# Altium project Metlino.PrjPcb (part 4 of 13)

## Sheet SDRAM_DDR3_4x16.SchDoc: Metlino
size 420 x 297 mm; CheckedBy: P.Kulik,T.Przywozki,W.Ruclo; Author: G.Kasprowicz; CompanyName: WUT ISE; DrawnBy: G.Kasprowicz; Organization: WUT ISE; Address1: PW ISE; Address2: Nowowiejska 15/19 00-665 Warsaw; Address3: gkasprow@gmail.com; DocumentNumber: 4; Revision: 2; SheetNumber: 4; SheetTotal: 29; ModifiedBy: -; CheckedDate: -; Title2: DDR3 x64; DivGrp: WUT ISE; Designer: G.Kasprowicz; ModifiedDate: -; ProjectName: Sensor Box
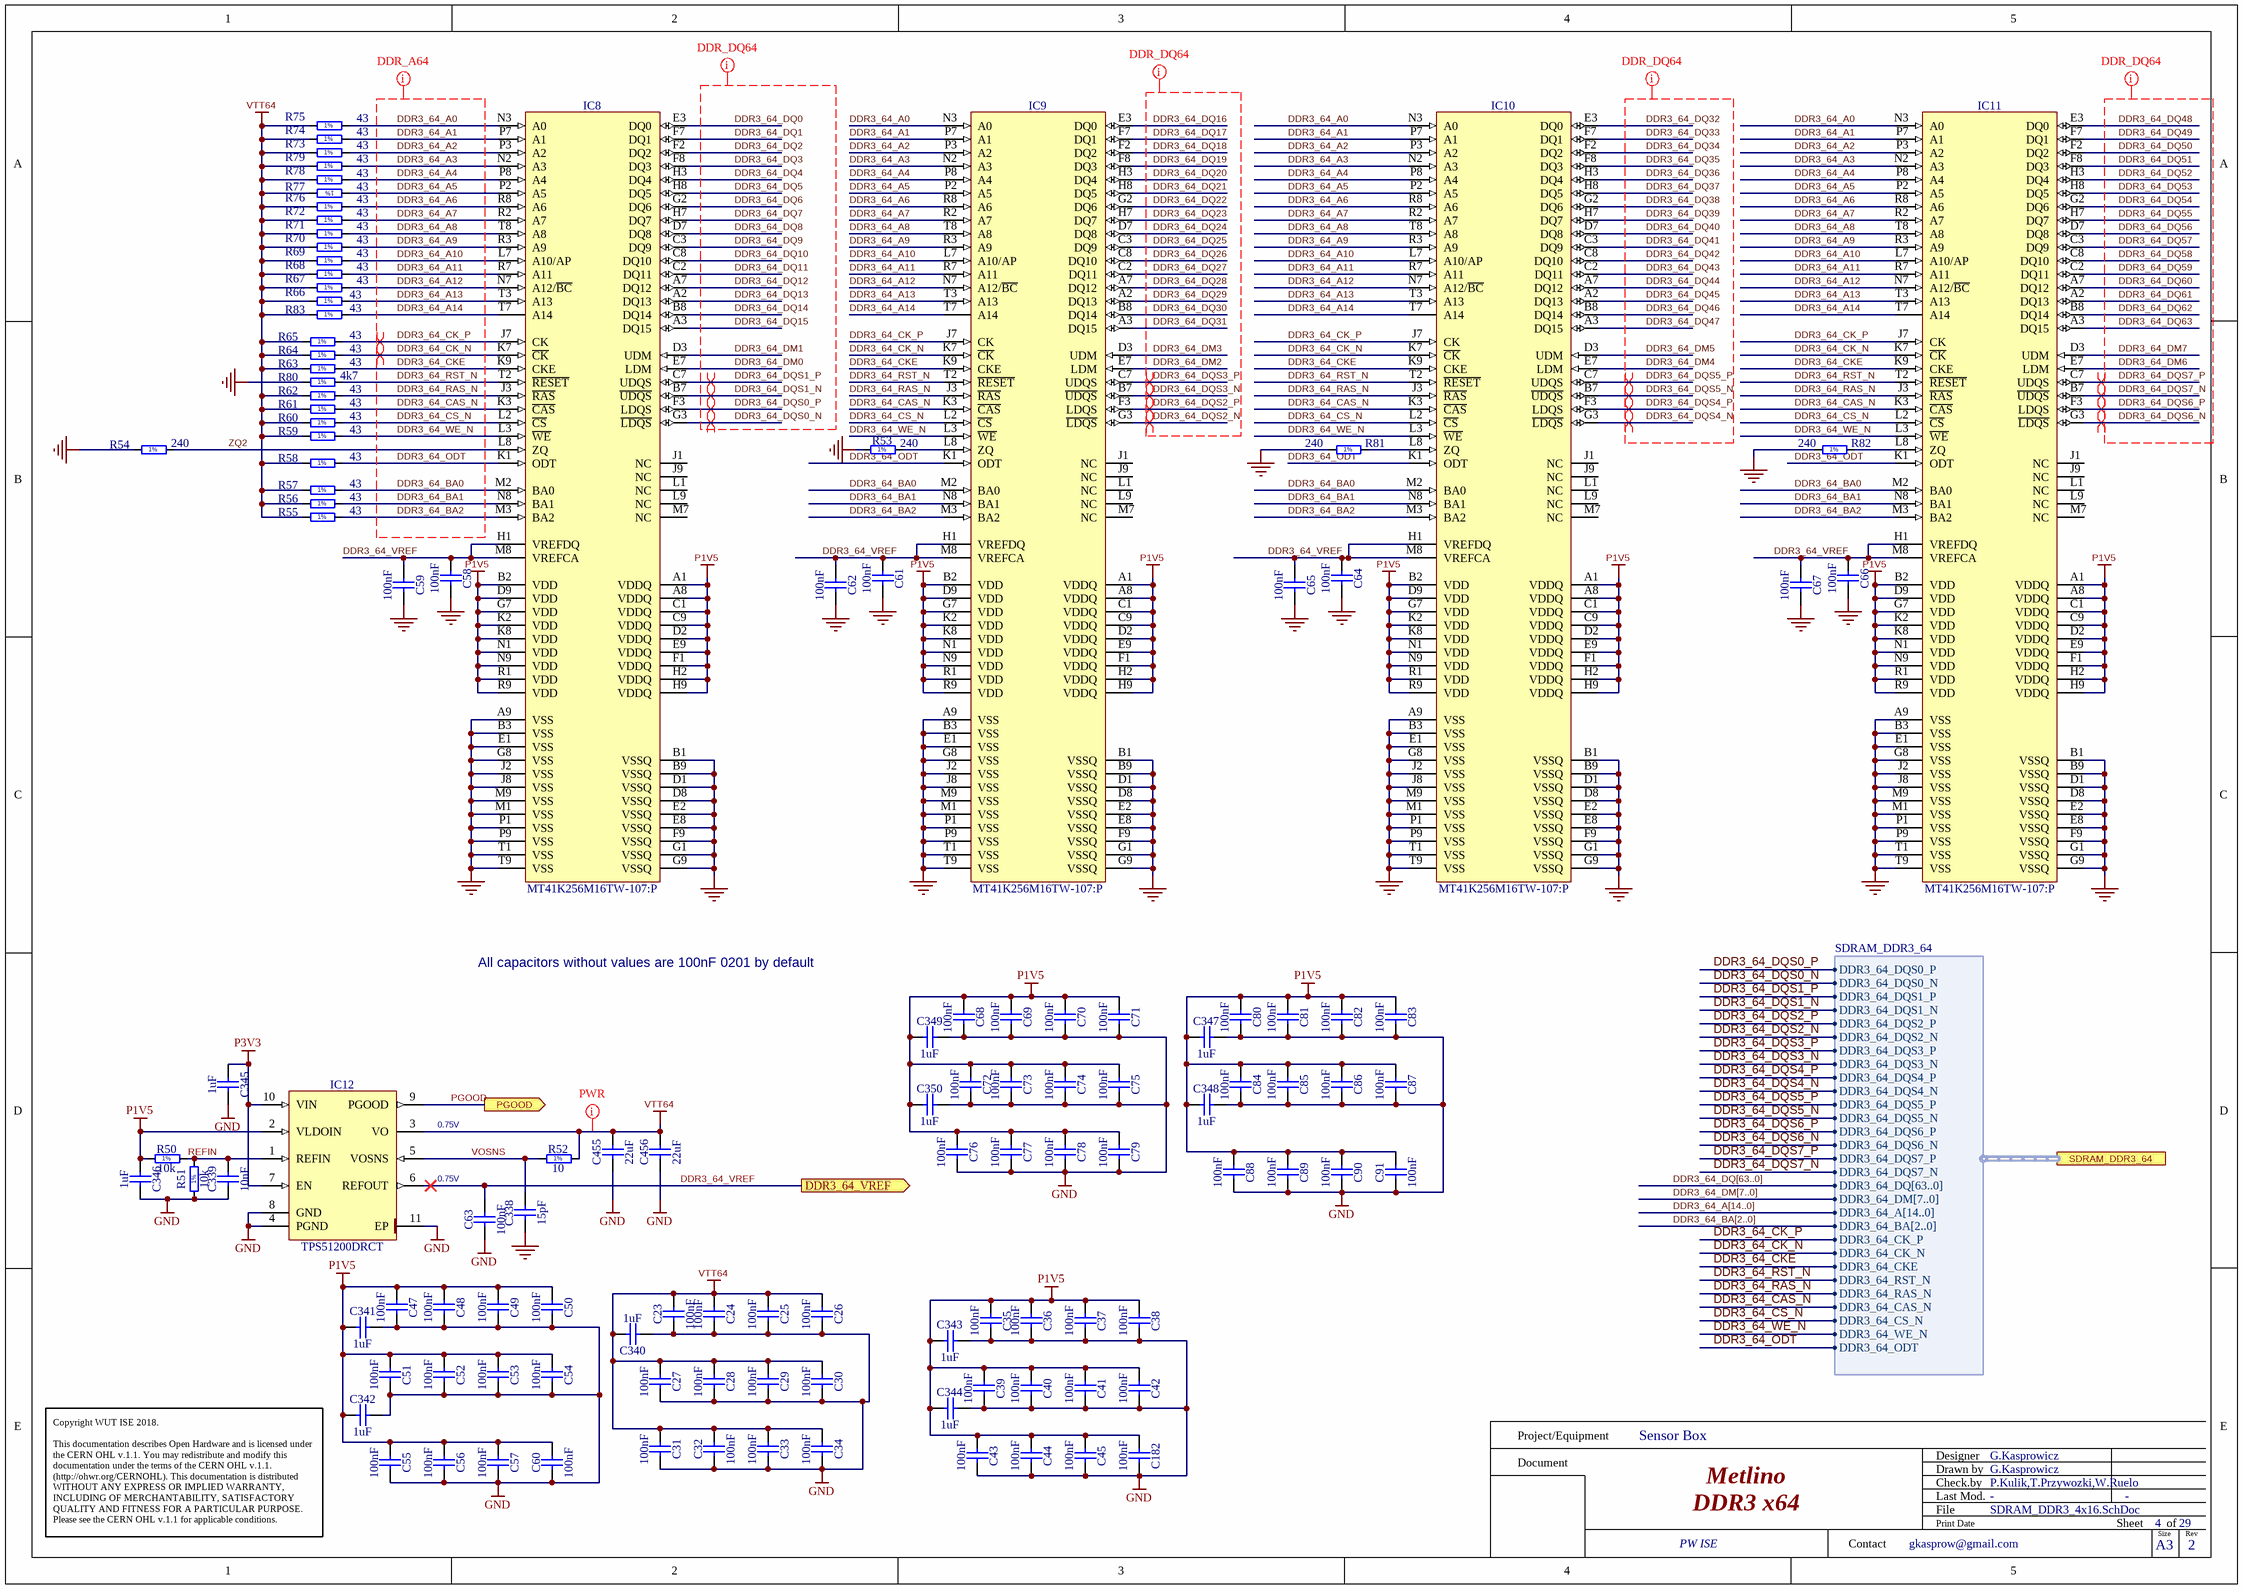
[diagram p6: SDRAM_DDR3_4x16.SchDoc]

### Parts
C23  100nF  [CAPC0603X33N]
C24  100nF  [CAPC0603X33N]
C25  100nF  [CAPC0603X33N]
C26  100nF  [CAPC0603X33N]
C27  100nF  [CAPC0603X33N]
C28  100nF  [CAPC0603X33N]
C29  100nF  [CAPC0603X33N]
C30  100nF  [CAPC0603X33N]
C31  100nF  [CAPC0603X33N]
C32  100nF  [CAPC0603X33N]
C33  100nF  [CAPC0603X33N]
C34  100nF  [CAPC0603X33N]
C35  100nF  [CAPC0603X33N]
C36  100nF  [CAPC0603X33N]
C37  100nF  [CAPC0603X33N]
C38  100nF  [CAPC0603X33N]
C39  100nF  [CAPC0603X33N]
C40  100nF  [CAPC0603X33N]
C41  100nF  [CAPC0603X33N]
C42  100nF  [CAPC0603X33N]
C43  100nF  [CAPC0603X33N]
C44  100nF  [CAPC0603X33N]
C45  100nF  [CAPC0603X33N]
C47  100nF  [CAPC0603X33N]
C48  100nF  [CAPC0603X33N]
C49  100nF  [CAPC0603X33N]
C50  100nF  [CAPC0603X33N]
C51  100nF  [CAPC0603X33N]
C52  100nF  [CAPC0603X33N]
C53  100nF  [CAPC0603X33N]
C54  100nF  [CAPC0603X33N]
C55  100nF  [CAPC0603X33N]
C56  100nF  [CAPC0603X33N]
C57  100nF  [CAPC0603X33N]
C58  100nF  [CAPC0603X33N]
C59  100nF  [CAPC0603X33N]
C60  100nF  [CAPC0603X33N]
C61  100nF  [CAPC0603X33N]
C62  100nF  [CAPC0603X33N]
C63  100nF  [CAPC0603X33N]
C64  100nF  [CAPC0603X33N]
C65  100nF  [CAPC0603X33N]
C66  100nF  [CAPC0603X33N]
C67  100nF  [CAPC0603X33N]
C68  100nF  [CAPC0603X33N]
C69  100nF  [CAPC0603X33N]
C70  100nF  [CAPC0603X33N]
C71  100nF  [CAPC0603X33N]
C72  100nF  [CAPC0603X33N]
C73  100nF  [CAPC0603X33N]
C74  100nF  [CAPC0603X33N]
C75  100nF  [CAPC0603X33N]
C76  100nF  [CAPC0603X33N]
C77  100nF  [CAPC0603X33N]
C78  100nF  [CAPC0603X33N]
C79  100nF  [CAPC0603X33N]
C80  100nF  [CAPC0603X33N]
C81  100nF  [CAPC0603X33N]
C82  100nF  [CAPC0603X33N]
C83  100nF  [CAPC0603X33N]
C84  100nF  [CAPC0603X33N]
C85  100nF  [CAPC0603X33N]
C86  100nF  [CAPC0603X33N]
C87  100nF  [CAPC0603X33N]
C88  100nF  [CAPC0603X33N]
C89  100nF  [CAPC0603X33N]
C90  100nF  [CAPC0603X33N]
C91  100nF  [CAPC0603X33N]
C182  100nF  [CAPC0603X33N]
C338  15pF  [CAPC1005X55N]
C339  10nF  [CAPC1005X55N]
C340  1uF  [CAPC1005X55N]
C341  1uF  [CAPC1005X55N]
C342  1uF  [CAPC1005X55N]
C343  1uF  [CAPC1005X55N]
C344  1uF  [CAPC1005X55N]
C345  1uF  [CAPC1005X55N]
C346  1uF  [CAPC1005X55N]
C347  1uF  [CAPC1005X55N]
C348  1uF  [CAPC1005X55N]
C349  1uF  [CAPC1005X55N]
C350  1uF  [CAPC1005X55N]
C455  22uF  [CAPC2012X135N]
C456  22uF  [CAPC2012X135N]
IC8  MT41K256M16TW-107:P  [BGA96C80P9X16_800X1400X120]
IC9  MT41K256M16TW-107:P  [BGA96C80P9X16_800X1400X120]
IC10  MT41K256M16TW-107:P  [BGA96C80P9X16_800X1400X120]
IC11  MT41K256M16TW-107:P  [BGA96C80P9X16_800X1400X120]
IC12  TPS51200DRCT  [TEXAS_DRC (S-PVSON-N10)]
R50  10k  [RESC1005X40N]
R51  10k  [RESC1005X40N]
R52  10  [RESC1005X40N]
R53  240  [RESC1005X40N]
R54  240  [RESC1005X40N]
R55  43  [RESC1005X40N]
R56  43  [RESC1005X40N]
R57  43  [RESC1005X40N]
R58  43  [RESC1005X40N]
R59  43  [RESC1005X40N]
R60  43  [RESC1005X40N]
R61  43  [RESC1005X40N]
R62  43  [RESC1005X40N]
R63  43  [RESC1005X40N]
R64  43  [RESC1005X40N]
R65  43  [RESC1005X40N]
R66  43  [RESC1005X40N]
R67  43  [RESC1005X40N]
R68  43  [RESC1005X40N]
R69  43  [RESC1005X40N]
R70  43  [RESC1005X40N]
R71  43  [RESC1005X40N]
R72  43  [RESC1005X40N]
R73  43  [RESC1005X40N]
R74  43  [RESC1005X40N]
R75  43  [RESC1005X40N]
R76  43  [RESC1005X40N]
R77  43  [RESC1005X40N]
R78  43  [RESC1005X40N]
R79  43  [RESC1005X40N]
R80  4k7  [RESC1005X40N]
R81  240  [RESC1005X40N]
R82  240  [RESC1005X40N]
R83  43  [RESC1005X40N]

### Ports
DDR3_64_VREF (out), PGOOD (out), SDRAM_DDR3_64 (harness SDRAM_DDR3_64)

### Harnesses
SDRAM_DDR3_64: DDR3_64_DQS0_P, DDR3_64_DQS0_N, DDR3_64_DQS1_P, DDR3_64_DQS1_N, DDR3_64_DQS2_P, DDR3_64_DQS2_N, DDR3_64_DQS3_P, DDR3_64_DQS3_N, DDR3_64_DQS4_P, DDR3_64_DQS4_N, DDR3_64_DQS5_P, DDR3_64_DQS5_N, DDR3_64_DQS6_P, DDR3_64_DQS6_N, DDR3_64_DQS7_P, DDR3_64_DQS7_N, DDR3_64_DQ[63..0], DDR3_64_DM[7..0], DDR3_64_A[14..0], DDR3_64_BA[2..0], DDR3_64_CK_P, DDR3_64_CK_N, DDR3_64_CKE, DDR3_64_RST_N, DDR3_64_RAS_N, DDR3_64_CAS_N, DDR3_64_CS_N, DDR3_64_WE_N, DDR3_64_ODT

### Nets
GND: C23.2 C24.2 C25.2 C26.2 C27.2 C28.2 C29.2 C30.2 C31.2 C32.2 C33.2 C34.2 C35.2 C36.2 C37.2 C38.2 C39.2 C40.2 C41.2 C42.2 C43.2 C44.2 C45.2 C47.2 C48.2 C49.2 C50.2 C51.2 C52.2 C53.2 C54.2 C55.2 C56.2 C57.2 C58.2 C59.2 C60.1 C61.2 C62.2 C63.1 C64.2 C65.2 C66.2 C67.2 C68.2 C69.2 C70.2 C71.2 C72.2 C73.2 C74.2 C75.2 C76.2 C77.2 C78.2 C79.2 C80.2 C81.2 C82.2 C83.2 C84.2 C85.2 C86.2 C87.2 C88.2 C89.2 C90.2 C91.1 C182.2 C338.1 C339.1 C340.2 C341.2 C342.2 C343.2 C344.2 C345.2 C346.2 C347.2 C348.2 C349.2 C350.2 C455.1 C456.1 IC8.A9(VSS) IC8.B1(VSSQ) IC8.B3(VSS) IC8.B9(VSSQ) IC8.D1(VSSQ) IC8.D8(VSSQ) IC8.E1(VSS) IC8.E2(VSSQ) IC8.E8(VSSQ) IC8.F9(VSSQ) IC8.G1(VSSQ) IC8.G8(VSS) IC8.G9(VSSQ) IC8.J2(VSS) IC8.J8(VSS) IC8.M1(VSS) IC8.M9(VSS) IC8.P1(VSS) IC8.P9(VSS) IC8.T1(VSS) IC8.T9(VSS) IC9.A9(VSS) IC9.B1(VSSQ) IC9.B3(VSS) IC9.B9(VSSQ) IC9.D1(VSSQ) IC9.D8(VSSQ) IC9.E1(VSS) IC9.E2(VSSQ) IC9.E8(VSSQ) IC9.F9(VSSQ) IC9.G1(VSSQ) IC9.G8(VSS) IC9.G9(VSSQ) IC9.J2(VSS) IC9.J8(VSS) IC9.M1(VSS) IC9.M9(VSS) IC9.P1(VSS) IC9.P9(VSS) IC9.T1(VSS) IC9.T9(VSS) IC10.A9(VSS) IC10.B1(VSSQ) IC10.B3(VSS) IC10.B9(VSSQ) IC10.D1(VSSQ) IC10.D8(VSSQ) IC10.E1(VSS) IC10.E2(VSSQ) IC10.E8(VSSQ) IC10.F9(VSSQ) IC10.G1(VSSQ) IC10.G8(VSS) IC10.G9(VSSQ) IC10.J2(VSS) IC10.J8(VSS) IC10.M1(VSS) IC10.M9(VSS) IC10.P1(VSS) IC10.P9(VSS) IC10.T1(VSS) IC10.T9(VSS) IC11.A9(VSS) IC11.B1(VSSQ) IC11.B3(VSS) IC11.B9(VSSQ) IC11.D1(VSSQ) IC11.D8(VSSQ) IC11.E1(VSS) IC11.E2(VSSQ) IC11.E8(VSSQ) IC11.F9(VSSQ) IC11.G1(VSSQ) IC11.G8(VSS) IC11.G9(VSSQ) IC11.J2(VSS) IC11.J8(VSS) IC11.M1(VSS) IC11.M9(VSS) IC11.P1(VSS) IC11.P9(VSS) IC11.T1(VSS) IC11.T9(VSS) IC12.4(PGND) IC12.8(GND) IC12.11(EP) R51.1 R53.1 R54.1 R80.1 R81.1 R82.1
P1V5: C35.1 C36.1 C37.1 C38.1 C39.1 C40.1 C41.1 C42.1 C43.1 C44.1 C45.1 C47.1 C48.1 C49.1 C50.1 C51.1 C52.1 C53.1 C54.1 C55.1 C56.1 C57.1 C60.2 C68.1 C69.1 C70.1 C71.1 C72.1 C73.1 C74.1 C75.1 C76.1 C77.1 C78.1 C79.1 C80.1 C81.1 C82.1 C83.1 C84.1 C85.1 C86.1 C87.1 C88.1 C89.1 C90.1 C91.2 C182.1 C341.1 C342.1 C343.1 C344.1 C346.1 C347.1 C348.1 C349.1 C350.1 IC8.A1(VDDQ) IC8.A8(VDDQ) IC8.B2(VDD) IC8.C1(VDDQ) IC8.C9(VDDQ) IC8.D2(VDDQ) IC8.D9(VDD) IC8.E9(VDDQ) IC8.F1(VDDQ) IC8.G7(VDD) IC8.H2(VDDQ) IC8.H9(VDDQ) IC8.K2(VDD) IC8.K8(VDD) IC8.N1(VDD) IC8.N9(VDD) IC8.R1(VDD) IC8.R9(VDD) IC9.A1(VDDQ) IC9.A8(VDDQ) IC9.B2(VDD) IC9.C1(VDDQ) IC9.C9(VDDQ) IC9.D2(VDDQ) IC9.D9(VDD) IC9.E9(VDDQ) IC9.F1(VDDQ) IC9.G7(VDD) IC9.H2(VDDQ) IC9.H9(VDDQ) IC9.K2(VDD) IC9.K8(VDD) IC9.N1(VDD) IC9.N9(VDD) IC9.R1(VDD) IC9.R9(VDD) IC10.A1(VDDQ) IC10.A8(VDDQ) IC10.B2(VDD) IC10.C1(VDDQ) IC10.C9(VDDQ) IC10.D2(VDDQ) IC10.D9(VDD) IC10.E9(VDDQ) IC10.F1(VDDQ) IC10.G7(VDD) IC10.H2(VDDQ) IC10.H9(VDDQ) IC10.K2(VDD) IC10.K8(VDD) IC10.N1(VDD) IC10.N9(VDD) IC10.R1(VDD) IC10.R9(VDD) IC11.A1(VDDQ) IC11.A8(VDDQ) IC11.B2(VDD) IC11.C1(VDDQ) IC11.C9(VDDQ) IC11.D2(VDDQ) IC11.D9(VDD) IC11.E9(VDDQ) IC11.F1(VDDQ) IC11.G7(VDD) IC11.H2(VDDQ) IC11.H9(VDDQ) IC11.K2(VDD) IC11.K8(VDD) IC11.N1(VDD) IC11.N9(VDD) IC11.R1(VDD) IC11.R9(VDD) IC12.2(VLDOIN) R50.1
P3V3: C345.1 IC12.7(EN) IC12.10(VIN)
VTT64: C23.1 C24.1 C25.1 C26.1 C27.1 C28.1 C29.1 C30.1 C31.1 C32.1 C33.1 C34.1 C340.1 C455.2 C456.2 IC12.3(VO) R52.2 R55.1 R56.1 R57.1 R58.1 R59.1 R60.1 R61.1 R62.1 R63.1 R64.1 R65.1 R66.1 R67.1 R68.1 R69.1 R70.1 R71.1 R72.1 R73.1 R74.1 R75.1 R76.1 R77.1 R78.1 R79.1 R83.1
DDR3_64_A0: IC8.N3(A0) IC9.N3(A0) IC10.N3(A0) IC11.N3(A0) R75.2
DDR3_64_A1: IC8.P7(A1) IC9.P7(A1) IC10.P7(A1) IC11.P7(A1) R74.2
DDR3_64_A2: IC8.P3(A2) IC9.P3(A2) IC10.P3(A2) IC11.P3(A2) R73.2
DDR3_64_A3: IC8.N2(A3) IC9.N2(A3) IC10.N2(A3) IC11.N2(A3) R79.2
DDR3_64_A4: IC8.P8(A4) IC9.P8(A4) IC10.P8(A4) IC11.P8(A4) R78.2
DDR3_64_A5: IC8.P2(A5) IC9.P2(A5) IC10.P2(A5) IC11.P2(A5) R77.2
DDR3_64_A6: IC8.R8(A6) IC9.R8(A6) IC10.R8(A6) IC11.R8(A6) R76.2
DDR3_64_A7: IC8.R2(A7) IC9.R2(A7) IC10.R2(A7) IC11.R2(A7) R72.2
DDR3_64_A8: IC8.T8(A8) IC9.T8(A8) IC10.T8(A8) IC11.T8(A8) R71.2
DDR3_64_A9: IC8.R3(A9) IC9.R3(A9) IC10.R3(A9) IC11.R3(A9) R70.2
DDR3_64_A10: IC8.L7(A10/AP) IC9.L7(A10/AP) IC10.L7(A10/AP) IC11.L7(A10/AP) R69.2
DDR3_64_A11: IC8.R7(A11) IC9.R7(A11) IC10.R7(A11) IC11.R7(A11) R68.2
DDR3_64_A12: IC8.N7(A12/~{BC}) IC9.N7(A12/~{BC}) IC10.N7(A12/~{BC}) IC11.N7(A12/~{BC}) R67.2
DDR3_64_A13: IC8.T3(A13) IC9.T3(A13) IC10.T3(A13) IC11.T3(A13) R66.2
DDR3_64_A14: IC8.T7(A14) IC9.T7(A14) IC10.T7(A14) IC11.T7(A14) R83.2
DDR3_64_BA0: IC8.M2(BA0) IC9.M2(BA0) IC10.M2(BA0) IC11.M2(BA0) R57.2
DDR3_64_BA1: IC8.N8(BA1) IC9.N8(BA1) IC10.N8(BA1) IC11.N8(BA1) R56.2
DDR3_64_BA2: IC8.M3(BA2) IC9.M3(BA2) IC10.M3(BA2) IC11.M3(BA2) R55.2
DDR3_64_CAS_N: IC8.K3(~{CAS}) IC9.K3(~{CAS}) IC10.K3(~{CAS}) IC11.K3(~{CAS}) R61.2 ; port SDRAM_DDR3_64.DDR3_64_CAS_N
DDR3_64_CK_N: IC8.K7(~{CK}) IC9.K7(~{CK}) IC10.K7(~{CK}) IC11.K7(~{CK}) R64.2 ; port SDRAM_DDR3_64.DDR3_64_CK_N
DDR3_64_CK_P: IC8.J7(CK) IC9.J7(CK) IC10.J7(CK) IC11.J7(CK) R65.2 ; port SDRAM_DDR3_64.DDR3_64_CK_P
DDR3_64_CKE: IC8.K9(CKE) IC9.K9(CKE) IC10.K9(CKE) IC11.K9(CKE) R63.2 ; port SDRAM_DDR3_64.DDR3_64_CKE
DDR3_64_CS_N: IC8.L2(~{CS}) IC9.L2(~{CS}) IC10.L2(~{CS}) IC11.L2(~{CS}) R60.2 ; port SDRAM_DDR3_64.DDR3_64_CS_N
DDR3_64_DM0: IC8.E7(LDM)
DDR3_64_DM1: IC8.D3(UDM)
DDR3_64_DM2: IC9.E7(LDM)
DDR3_64_DM3: IC9.D3(UDM)
DDR3_64_DM4: IC10.E7(LDM)
DDR3_64_DM5: IC10.D3(UDM)
DDR3_64_DM6: IC11.E7(LDM)
DDR3_64_DM7: IC11.D3(UDM)
DDR3_64_DQ0: IC8.E3(DQ0)
DDR3_64_DQ1: IC8.F7(DQ1)
DDR3_64_DQ2: IC8.F2(DQ2)
DDR3_64_DQ3: IC8.F8(DQ3)
DDR3_64_DQ4: IC8.H3(DQ4)
DDR3_64_DQ5: IC8.H8(DQ5)
DDR3_64_DQ6: IC8.G2(DQ6)
DDR3_64_DQ7: IC8.H7(DQ7)
DDR3_64_DQ8: IC8.D7(DQ8)
DDR3_64_DQ9: IC8.C3(DQ9)
DDR3_64_DQ10: IC8.C8(DQ10)
DDR3_64_DQ11: IC8.C2(DQ11)
DDR3_64_DQ12: IC8.A7(DQ12)
DDR3_64_DQ13: IC8.A2(DQ13)
DDR3_64_DQ14: IC8.B8(DQ14)
DDR3_64_DQ15: IC8.A3(DQ15)
DDR3_64_DQ16: IC9.E3(DQ0)
DDR3_64_DQ17: IC9.F7(DQ1)
DDR3_64_DQ18: IC9.F2(DQ2)
DDR3_64_DQ19: IC9.F8(DQ3)
DDR3_64_DQ20: IC9.H3(DQ4)
DDR3_64_DQ21: IC9.H8(DQ5)
DDR3_64_DQ22: IC9.G2(DQ6)
DDR3_64_DQ23: IC9.H7(DQ7)
DDR3_64_DQ24: IC9.D7(DQ8)
DDR3_64_DQ25: IC9.C3(DQ9)
DDR3_64_DQ26: IC9.C8(DQ10)
DDR3_64_DQ27: IC9.C2(DQ11)
DDR3_64_DQ28: IC9.A7(DQ12)
DDR3_64_DQ29: IC9.A2(DQ13)
DDR3_64_DQ30: IC9.B8(DQ14)
DDR3_64_DQ31: IC9.A3(DQ15)
DDR3_64_DQ32: IC10.E3(DQ0)
DDR3_64_DQ33: IC10.F7(DQ1)
DDR3_64_DQ34: IC10.F2(DQ2)
DDR3_64_DQ35: IC10.F8(DQ3)
DDR3_64_DQ36: IC10.H3(DQ4)
DDR3_64_DQ37: IC10.H8(DQ5)
DDR3_64_DQ38: IC10.G2(DQ6)
DDR3_64_DQ39: IC10.H7(DQ7)
DDR3_64_DQ40: IC10.D7(DQ8)
DDR3_64_DQ41: IC10.C3(DQ9)
DDR3_64_DQ42: IC10.C8(DQ10)
DDR3_64_DQ43: IC10.C2(DQ11)
DDR3_64_DQ44: IC10.A7(DQ12)
DDR3_64_DQ45: IC10.A2(DQ13)
DDR3_64_DQ46: IC10.B8(DQ14)
DDR3_64_DQ47: IC10.A3(DQ15)
DDR3_64_DQ48: IC11.E3(DQ0)
DDR3_64_DQ49: IC11.F7(DQ1)
DDR3_64_DQ50: IC11.F2(DQ2)
DDR3_64_DQ51: IC11.F8(DQ3)
DDR3_64_DQ52: IC11.H3(DQ4)
DDR3_64_DQ53: IC11.H8(DQ5)
DDR3_64_DQ54: IC11.G2(DQ6)
DDR3_64_DQ55: IC11.H7(DQ7)
DDR3_64_DQ56: IC11.D7(DQ8)
DDR3_64_DQ57: IC11.C3(DQ9)
DDR3_64_DQ58: IC11.C8(DQ10)
DDR3_64_DQ59: IC11.C2(DQ11)
DDR3_64_DQ60: IC11.A7(DQ12)
DDR3_64_DQ61: IC11.A2(DQ13)
DDR3_64_DQ62: IC11.B8(DQ14)
DDR3_64_DQ63: IC11.A3(DQ15)
DDR3_64_DQS0_N: IC8.G3(~{LDQS}) ; port SDRAM_DDR3_64.DDR3_64_DQS0_N
DDR3_64_DQS0_P: IC8.F3(LDQS) ; port SDRAM_DDR3_64.DDR3_64_DQS0_P
DDR3_64_DQS1_N: IC8.B7(~{UDQS}) ; port SDRAM_DDR3_64.DDR3_64_DQS1_N
DDR3_64_DQS1_P: IC8.C7(UDQS) ; port SDRAM_DDR3_64.DDR3_64_DQS1_P
DDR3_64_DQS2_N: IC9.G3(~{LDQS}) ; port SDRAM_DDR3_64.DDR3_64_DQS2_N
DDR3_64_DQS2_P: IC9.F3(LDQS) ; port SDRAM_DDR3_64.DDR3_64_DQS2_P
DDR3_64_DQS3_N: IC9.B7(~{UDQS}) ; port SDRAM_DDR3_64.DDR3_64_DQS3_N
DDR3_64_DQS3_P: IC9.C7(UDQS) ; port SDRAM_DDR3_64.DDR3_64_DQS3_P
DDR3_64_DQS4_N: IC10.G3(~{LDQS}) ; port SDRAM_DDR3_64.DDR3_64_DQS4_N
DDR3_64_DQS4_P: IC10.F3(LDQS) ; port SDRAM_DDR3_64.DDR3_64_DQS4_P
DDR3_64_DQS5_N: IC10.B7(~{UDQS}) ; port SDRAM_DDR3_64.DDR3_64_DQS5_N
DDR3_64_DQS5_P: IC10.C7(UDQS) ; port SDRAM_DDR3_64.DDR3_64_DQS5_P
DDR3_64_DQS6_N: IC11.G3(~{LDQS}) ; port SDRAM_DDR3_64.DDR3_64_DQS6_N
DDR3_64_DQS6_P: IC11.F3(LDQS) ; port SDRAM_DDR3_64.DDR3_64_DQS6_P
DDR3_64_DQS7_N: IC11.B7(~{UDQS}) ; port SDRAM_DDR3_64.DDR3_64_DQS7_N
DDR3_64_DQS7_P: IC11.C7(UDQS) ; port SDRAM_DDR3_64.DDR3_64_DQS7_P
DDR3_64_ODT: IC8.K1(ODT) IC9.K1(ODT) IC10.K1(ODT) IC11.K1(ODT) R58.2 ; port SDRAM_DDR3_64.DDR3_64_ODT
DDR3_64_RAS_N: IC8.J3(~{RAS}) IC9.J3(~{RAS}) IC10.J3(~{RAS}) IC11.J3(~{RAS}) R62.2 ; port SDRAM_DDR3_64.DDR3_64_RAS_N
DDR3_64_RST_N: IC8.T2(~{RESET}) IC9.T2(~{RESET}) IC10.T2(~{RESET}) IC11.T2(~{RESET}) R80.2 ; port SDRAM_DDR3_64.DDR3_64_RST_N
DDR3_64_VREF: C58.1 C59.1 C61.1 C62.1 C63.2 C64.1 C65.1 C66.1 C67.1 IC8.H1(VREFDQ) IC8.M8(VREFCA) IC9.H1(VREFDQ) IC9.M8(VREFCA) IC10.H1(VREFDQ) IC10.M8(VREFCA) IC11.H1(VREFDQ) IC11.M8(VREFCA) IC12.6(REFOUT) ; port DDR3_64_VREF
DDR3_64_WE_N: IC8.L3(~{WE}) IC9.L3(~{WE}) IC10.L3(~{WE}) IC11.L3(~{WE}) R59.2 ; port SDRAM_DDR3_64.DDR3_64_WE_N
PGOOD: IC12.9(PGOOD) ; port PGOOD
REFIN: C339.2 IC12.1(REFIN) R50.2 R51.2
VOSNS: C338.2 IC12.5(VOSNS) R52.1
ZQ2: IC8.L8(ZQ) R54.2
NetIC9_L8: IC9.L8(ZQ) R53.2
NetIC10_L8: IC10.L8(ZQ) R81.2
NetIC11_L8: IC11.L8(ZQ) R82.2

Not connected (* = marked no-connect by the designer): IC8 J1(NC) J9(NC) L1(NC) L9(NC) M7(NC); IC9 J1(NC) J9(NC) L1(NC) L9(NC) M7(NC); IC10 J1(NC) J9(NC) L1(NC) L9(NC) M7(NC); IC11 J1(NC) J9(NC) L1(NC) L9(NC) M7(NC)

### Buses and harness runs
bus DDR3_64_A[14..0]
bus DDR3_64_BA[2..0]
bus DDR3_64_DM[7..0]
bus DDR3_64_DQ[63..0]

### Layout directives
net class DDR_DQ64: DDR3_64_DM0, DDR3_64_DM1, DDR3_64_DM2, DDR3_64_DM3, DDR3_64_DM4, DDR3_64_DM5, DDR3_64_DM6, DDR3_64_DM7, DDR3_64_DQ0, DDR3_64_DQ1, DDR3_64_DQ2, DDR3_64_DQ3, DDR3_64_DQ4, DDR3_64_DQ5, DDR3_64_DQ6, DDR3_64_DQ7, DDR3_64_DQ8, DDR3_64_DQ9, DDR3_64_DQ10, DDR3_64_DQ11, DDR3_64_DQ12, DDR3_64_DQ13, DDR3_64_DQ14, DDR3_64_DQ15, DDR3_64_DQ16, DDR3_64_DQ17, DDR3_64_DQ18, DDR3_64_DQ19, DDR3_64_DQ20, DDR3_64_DQ21, DDR3_64_DQ22, DDR3_64_DQ23, DDR3_64_DQ24, DDR3_64_DQ25, DDR3_64_DQ26, DDR3_64_DQ27, DDR3_64_DQ28, DDR3_64_DQ29, DDR3_64_DQ30, DDR3_64_DQ31, DDR3_64_DQ32, DDR3_64_DQ33, DDR3_64_DQ34, DDR3_64_DQ35, DDR3_64_DQ36, DDR3_64_DQ37, DDR3_64_DQ38, DDR3_64_DQ39, DDR3_64_DQ40, DDR3_64_DQ41, DDR3_64_DQ42, DDR3_64_DQ43, DDR3_64_DQ44, DDR3_64_DQ45, DDR3_64_DQ46, DDR3_64_DQ47, DDR3_64_DQ48, DDR3_64_DQ49, DDR3_64_DQ50, DDR3_64_DQ51, DDR3_64_DQ52, DDR3_64_DQ53, DDR3_64_DQ54, DDR3_64_DQ55, DDR3_64_DQ56, DDR3_64_DQ57, DDR3_64_DQ58, DDR3_64_DQ59, DDR3_64_DQ60, DDR3_64_DQ61, DDR3_64_DQ62, DDR3_64_DQ63, DDR3_64_DQS0_N, DDR3_64_DQS0_P, DDR3_64_DQS1_N, DDR3_64_DQS1_P, DDR3_64_DQS2_N, DDR3_64_DQS2_P, DDR3_64_DQS3_N, DDR3_64_DQS3_P, DDR3_64_DQS4_N, DDR3_64_DQS4_P, DDR3_64_DQS5_N, DDR3_64_DQS5_P, DDR3_64_DQS6_N, DDR3_64_DQS6_P, DDR3_64_DQS7_N, DDR3_64_DQS7_P
differential pair: DDR3_64_CK_N, DDR3_64_CK_P, DDR3_64_DQS0_N, DDR3_64_DQS0_P, DDR3_64_DQS1_N, DDR3_64_DQS1_P, DDR3_64_DQS2_N, DDR3_64_DQS2_P, DDR3_64_DQS3_N, DDR3_64_DQS3_P, DDR3_64_DQS4_N, DDR3_64_DQS4_P, DDR3_64_DQS5_N, DDR3_64_DQS5_P, DDR3_64_DQS6_N, DDR3_64_DQS6_P, DDR3_64_DQS7_N, DDR3_64_DQS7_P
net class PWR: VTT64
net class DDR_A64: DDR3_64_A0, DDR3_64_A1, DDR3_64_A2, DDR3_64_A3, DDR3_64_A4, DDR3_64_A5, DDR3_64_A6, DDR3_64_A7, DDR3_64_A8, DDR3_64_A9, DDR3_64_A10, DDR3_64_A11, DDR3_64_A12, DDR3_64_A13, DDR3_64_A14, DDR3_64_BA0, DDR3_64_BA1, DDR3_64_BA2, DDR3_64_CAS_N, DDR3_64_CK_N, DDR3_64_CK_P, DDR3_64_CKE, DDR3_64_CS_N, DDR3_64_ODT, DDR3_64_RAS_N, DDR3_64_RST_N, DDR3_64_WE_N

### Notes on the sheet
- All capacitors without values are 100nF 0201 by default
- (near IC12) 0.75V
- 0.75V
- Project/Equipment
- Document
- Designer
- Drawn by
- Check.by
- Copyright WUT ISE 2018.
  This documentation describes Open Hardware and is licensed under the CERN OHL v.1.1. You may redistribute and modify this documentation under the terms of the CERN OHL v.1.1. (http://ohwr.org/CERNOHL). This documentation is distributed WITHOUT ANY EXPRESS OR IMPLIED WARRANTY, INCLUDING OF MERCHANTABILITY, SATISFACTORY QUALITY AND FITNESS FOR A PARTICULAR PURPOSE. Please see the CERN OHL v.1.1 for applicable conditions.
- Contact
- File
- Last Mod.
- Print Date
- Sheet
- Size
- A3
- of
- Rev
- (in symbol R0402_4K7_1%_0.0625W_100PPM) 1%
- (in symbol R0402_10K_1%_0.0625W_100PPM) 1%
- (in symbol R0402_10R_1%_0.0625W_200PPM) 1%
- (in symbol R0402_43R_1%_0.0625W_100PPM) 1%
- (in symbol R0402_240R_1%_0.0625W_100PPM) 1%

### Library data of the parts
C23-C45 C47-C57 C60 C63 C68-C91 C182 = CC0201_100NF_6.3V_10%_X5R: Non-polarised capacitor; Manufacturer: GENERIC; Manufacturer1 Part Number: 02016D104KAT2A; Part Description: SMD Multilayer Chip Ceramic Capacitor; TC: X5R; Tolerance: ±10%; Voltage: 6.3V; Author: CERN DEM JLC; Case: 0201; Component Kind: Standard; Component Type: Standard; CreateDate: 03.12.2007; HelpURL: \\cern.ch\dfs\Applications\Altium\Datasheets\CC0201_X5R_AVX.pdf; LatestRevisionDate: 03.12.2007; Manufacturer Part Number: CC0201_100NF_6.3V_10%_X5R; Manufacturer1 ComponentHeight: 0.33mm; Manufacturer1 Example: AVX; Mounted: Yes; Part Number: CC0201_100NF_6.3V_10%_X5R; Pin Count: 2; SMD: Yes; Socket: No; Status: Not Recommended; Value: 100nF; Sense: No
C58 C59 C61 C62 C64-C67 = CC0201_100NF_6.3V_10%_X5R: Non-polarised capacitor; Manufacturer: GENERIC; Part Description: SMD Multilayer Chip Ceramic Capacitor; Manufacturer1 Part Number: 02016D104KAT2A; Tolerance: ±10%; Voltage: 6.3V; TC: X5R; Manufacturer Part Number: CC0201_100NF_6.3V_10%_X5R; Part Number: CC0201_100NF_6.3V_10%_X5R; Value: 100nF; Component Kind: Standard; Component Type: Standard; Pin Count: 2; Status: Not Recommended; Case: 0201; Mounted: Yes; Socket: No; SMD: Yes; Sense: No; Manufacturer1 Example: AVX; Manufacturer1 ComponentHeight: 0.33mm; HelpURL: \\cern.ch\dfs\Applications\Altium\Datasheets\CC0201_X5R_AVX.pdf; Author: CERN DEM JLC; CreateDate: 03.12.2007; LatestRevisionDate: 03.12.2007
C338 = CC0402_15PF_50V_5%_C0G: Non-polarised capacitor; Manufacturer: GENERIC; Part Description: SMD Multilayer Chip Ceramic Capacitor; Manufacturer1 Part Number: C0402C150J5GACTU; Tolerance: ±5%; Voltage: 50V; TC: C0G/NP0; Manufacturer Part Number: CC0402_15PF_50V_5%_C0G; Part Number: CC0402_15PF_50V_5%_C0G; Value: 15pF; Component Kind: Standard; Component Type: Standard; Pin Count: 2; Status: Preferred; Case: 0402; Mounted: Yes; Socket: No; SMD: Yes; Sense: No; Manufacturer1 Example: KEMET; Manufacturer1 ComponentHeight: 0.55mm; HelpURL: \\cern.ch\dfs\Applications\Altium\Datasheets\CC0805_C0G_KEMET_(Commercial Grade).pdf; Author: CERN DEM JLC; CreateDate: 03.12.2007; LatestRevisionDate: 22.04.2015
C339 = CC0402_10NF_25V_10%_X7R: Non-polarised capacitor; Manufacturer: GENERIC; Part Description: SMD Multilayer Chip Ceramic Capacitor; Manufacturer1 Part Number: C1005X7R1E103KT; Tolerance: ±10%; Voltage: 25V; TC: X7R; Manufacturer Part Number: CC0402_10NF_25V_10%_X7R; Part Number: CC0402_10NF_25V_10%_X7R; Value: 10nF; Component Kind: Standard; Component Type: Standard; Pin Count: 2; Status: Preferred; Case: 0402; Mounted: Yes; Socket: No; SMD: Yes; Sense: No; Manufacturer1 Example: TDK; Manufacturer1 ComponentHeight: 0.55mm; HelpURL: \\cern.ch\dfs\Applications\Altium\Datasheets\CC0402_X7R_TDK_C.pdf; Author: CERN DEM JLC; CreateDate: 25.10.2012; LatestRevisionDate: 25.10.2012
C340-C350 = CC0402_1UF_16V_10%_X5R: Non-polarised capacitor; Manufacturer: GENERIC; Part Description: SMD Multilayer Chip Ceramic Capacitor; Manufacturer1 Part Number: C1005X5R1C105KT; Tolerance: ±10%; Voltage: 16V; TC: X5R; Manufacturer Part Number: CC0402_1UF_16V_10%_X5R; Part Number: CC0402_1UF_16V_10%_X5R; Value: 1uF; Component Kind: Standard; Component Type: Standard; Pin Count: 2; Status: Preferred; Case: 0402; Mounted: Yes; Socket: No; SMD: Yes; Sense: No; Manufacturer1 Example: TDK; Manufacturer1 ComponentHeight: 0.55mm; HelpURL: \\cern.ch\dfs\Applications\Altium\Datasheets\CC0402_X5R_TDK_C.pdf; Author: CERN DEM JLC; CreateDate: 25.10.2012; LatestRevisionDate: 25.10.2012
C455 C456 = CC0805_22UF_10V_+80%-20%_Y5V: Non-polarised capacitor; Manufacturer: GENERIC; Part Description: SMD Multilayer Chip Ceramic Capacitor; Manufacturer1 Part Number: 2222 241 19881; Voltage: 10V; TC: Y5V; Manufacturer Part Number: CC0805_22UF_10V_+80%-20%_Y5V; Part Number: CC0805_22UF_10V_+80%-20%_Y5V; Tolerance: +80% -20%; Value: 22uF; Component Kind: Standard; Component Type: Standard; Pin Count: 2; Status: Preferred; Case: 0805; Mounted: Yes; Socket: No; SMD: Yes; Sense: No; Manufacturer1 Example: PHYCOMP; Manufacturer1 ComponentHeight: 1.45mm; HelpURL: \\cern.ch\dfs\Applications\Altium\Datasheets\CC0805_Y5V_PHYCOMP.pdf; Author: CERN DEM JLC; CreateDate: 03.12.2007; LatestRevisionDate: 03.12.2007
IC8-IC11 = MT41K256M16TW-107:P: 32 Meg x 16 x 8 Banks DDR3L SDRAM; Manufacturer: MICRON TECHNOLOGY; Part Description: +1.5V, 4Gb (32Meg x 16 x 8 banks) DDR3L SDRAM; PressFit: No; Bonding: No; Manufacturer Part Number: MT41K256M16TW-107:P; Part Number: MT41K256M16TW-107:P; Component Kind: Standard; Component Type: Standard; Device: MT41K256M16TW-107:P; PackageDescription: BGA 0.8mm, Pitch, Square 96 Pin, 9 Columns x 16 Rows, Body 14mm X 8mm X 1.2mm H; Pin Count: 96; Case: BGA96; Mounted: Yes; Socket: No; SMD: Yes; Sense: No; ComponentHeight: 1.2mm; HelpURL: \\cern.ch\dfs\Applications\Altium\Datasheets\MT41K256M16TW-107-P.pdf; Author: CERN DEM MR; CreateDate: 14.12.2015; LatestRevisionDate: 14.12.2015
IC12 = TPS51200DRCT: Sink/Source DDR Termination Regulator; Manufacturer: TEXAS INSTRUMENTS; Part Description: 3.3V Sink/Source DDR Termination Regulator; PressFit: No; Bonding: No; Manufacturer Part Number: TPS51200DRCT; PackageDescription: SON, 0.50mm Pitch, 10-pin, 3.00mm W  X 3.00mm L X 1.00mm Height, (w/thermal tab 1.75 X 2.50 mm); Part Number: TPS51200DRCT; Component Kind: Standard; Component Type: Standard; Device: TPS51200DRCT; Pin Count: 11; Case: SON10; Mounted: Yes; Socket: No; SMD: Yes; Sense: No; ComponentHeight: 1mm; HelpURL: \\cern.ch\dfs\Applications\Altium\Datasheets\TPS51200DRCT.pdf; Author: CERN DEM JLC; CreateDate: 03.02.2010; LatestRevisionDate: 06.11.2013
R50 R51 = R0402_10K_1%_0.0625W_100PPM: Resistor - 1%; Manufacturer: GENERIC; Part Description: General Purpose Thick Film Chip Resistor; Manufacturer1 Part Number: 232270671003L; TC: ±100ppm/°C; PressFit: No; Manufacturer Part Number: R0402_10K_1%_0.0625W_100PPM; Part Number: R0402_10K_1%_0.0625W_100PPM; Tolerance: ±1%; Value: 10k; Component Kind: Standard; Component Type: Standard; Pin Count: 2; Status: Not Recommended; Power: 0.0625W; Case: 0402; Mounted: Yes; Sense: No; Socket: No; SMD: Yes; Manufacturer1 Example: YAGEO PHYCOMP; Manufacturer1 ComponentHeight: 0.4mm; HelpURL: \\cern.ch\dfs\Applications\Altium\Datasheets\R0402_Phycomp_RC0402.pdf; Author: CERN DEM JLC; CreateDate: 03.12.2007; LatestRevisionDate: 17.10.2012
R52 = R0402_10R_1%_0.0625W_200PPM: Resistor - 1%; Manufacturer: GENERIC; Part Description: General Purpose Thick Film Chip Resistor; Manufacturer1 Part Number: 232270671009L; TC: ±200ppm/°C; PressFit: No; Manufacturer Part Number: R0402_10R_1%_0.0625W_200PPM; Part Number: R0402_10R_1%_0.0625W_200PPM; Tolerance: ±1%; Value: 10; Component Kind: Standard; Component Type: Standard; Pin Count: 2; Status: Not Recommended; Power: 0.0625W; Case: 0402; Mounted: Yes; Sense: No; Socket: No; SMD: Yes; Manufacturer1 Example: YAGEO PHYCOMP; Manufacturer1 ComponentHeight: 0.4mm; HelpURL: \\cern.ch\dfs\Applications\Altium\Datasheets\R0402_Phycomp_RC0402.pdf; Author: CERN DEM JLC; CreateDate: 24.06.2009; LatestRevisionDate: 17.10.2012
R53 R54 R81 R82 = R0402_240R_1%_0.0625W_100PPM: Resistor - 1%; Manufacturer: GENERIC; Part Description: General Purpose Thick Film Chip Resistor; Manufacturer1 Part Number: 232270672401L; TC: ±100ppm/°C; PressFit: No; Manufacturer Part Number: R0402_240R_1%_0.0625W_100PPM; Part Number: R0402_240R_1%_0.0625W_100PPM; Tolerance: ±1%; Value: 240; Component Kind: Standard; Component Type: Standard; Pin Count: 2; Status: Not Recommended; Power: 0.0625W; Case: 0402; Mounted: Yes; Sense: No; Socket: No; SMD: Yes; Manufacturer1 Example: YAGEO PHYCOMP; Manufacturer1 ComponentHeight: 0.4mm; HelpURL: \\cern.ch\dfs\Applications\Altium\Datasheets\R0402_Phycomp_RC0402.pdf; Author: CERN DEM JLC; CreateDate: 03.12.2007; LatestRevisionDate: 17.10.2012
R55-R79 R83 = R0402_43R_1%_0.0625W_100PPM: Resistor - 1%; Manufacturer: GENERIC; Part Description: General Purpose Thick Film Chip Resistor; Manufacturer1 Part Number: 232270674309L; TC: ±100ppm/°C; PressFit: No; Manufacturer Part Number: R0402_43R_1%_0.0625W_100PPM; Part Number: R0402_43R_1%_0.0625W_100PPM; Tolerance: ±1%; Value: 43; Component Kind: Standard; Component Type: Standard; Pin Count: 2; Status: Not Recommended; Power: 0.0625W; Case: 0402; Mounted: Yes; Sense: No; Socket: No; SMD: Yes; Manufacturer1 Example: YAGEO PHYCOMP; Manufacturer1 ComponentHeight: 0.4mm; HelpURL: \\cern.ch\dfs\Applications\Altium\Datasheets\R0402_Phycomp_RC0402.pdf; Author: CERN DEM JLC; CreateDate: 03.12.2007; LatestRevisionDate: 17.10.2012
R80 = R0402_4K7_1%_0.0625W_100PPM: Resistor - 1%; Manufacturer: GENERIC; Part Description: General Purpose Thick Film Chip Resistor; Manufacturer1 Part Number: 232270674702L; TC: ±100ppm/°C; PressFit: No; Manufacturer Part Number: R0402_4K7_1%_0.0625W_100PPM; Part Number: R0402_4K7_1%_0.0625W_100PPM; Tolerance: ±1%; Value: 4k7; Component Kind: Standard; Component Type: Standard; Pin Count: 2; Status: Not Recommended; Power: 0.0625W; Case: 0402; Mounted: Yes; Sense: No; Socket: No; SMD: Yes; Manufacturer1 Example: YAGEO PHYCOMP; Manufacturer1 ComponentHeight: 0.4mm; HelpURL: \\cern.ch\dfs\Applications\Altium\Datasheets\R0402_Phycomp_RC0402.pdf; Author: CERN DEM JLC; CreateDate: 03.12.2007; LatestRevisionDate: 17.10.2012

## Sheet JTAG_Configuration.SchDoc: Metlino
size 420 x 297 mm; CheckedBy: P.Kulik,T.Przywozki,W.Ruclo; Author: G.Kasprowicz; CompanyName: WUT ISE; DrawnBy: G.Kasprowicz; Organization: WUT ISE; Address1: PW ISE; Address2: Nowowiejska 15/19 00-665 Warsaw; Address3: gkasprow@gmail.com; DocumentNumber: 19; Revision: 2; SheetNumber: 19; SheetTotal: 29; ModifiedBy: -; CheckedDate: -; Title2: JTAG; DivGrp: WUT ISE; Designer: G.Kasprowicz; ModifiedDate: -; ProjectName: Sensor Box
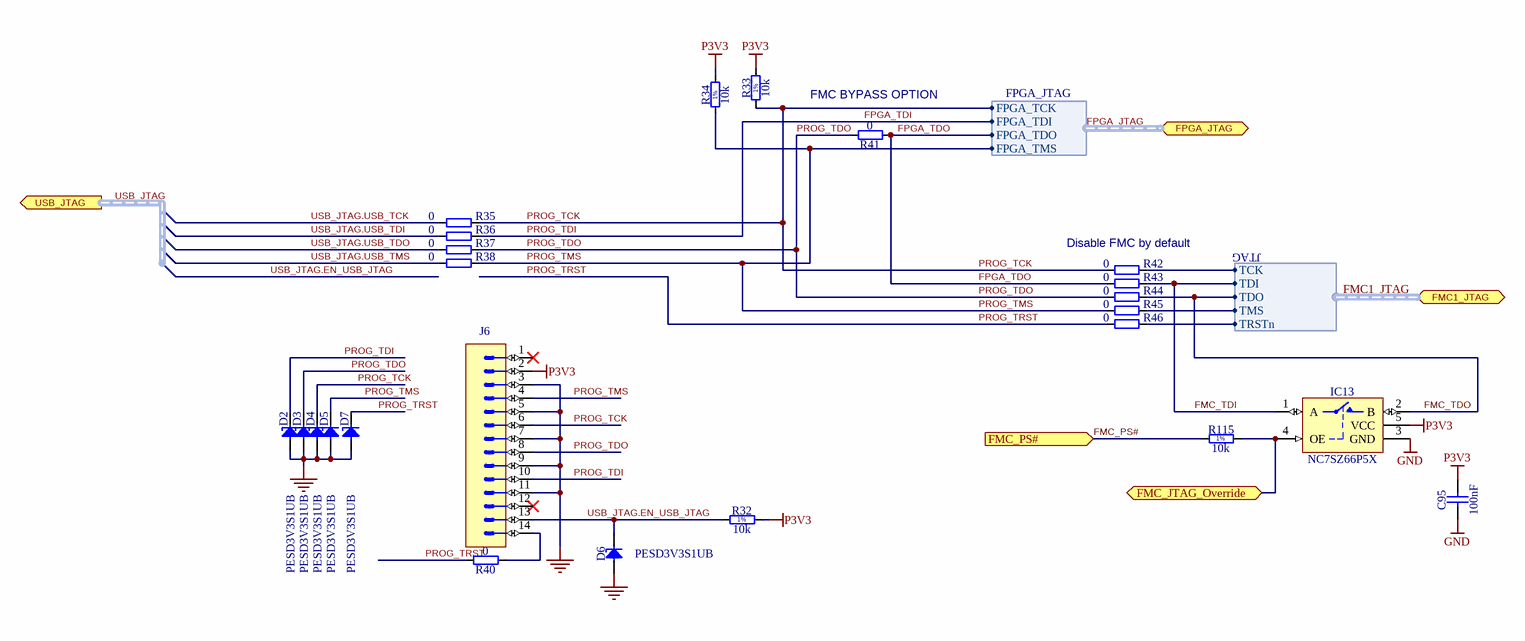
[diagram p7: JTAG_Configuration.SchDoc]

### Parts
C95  100nF  [CAPC0603X33N]
D2  PESD3V3S1UB  [SODFL1608X65N]
D3  PESD3V3S1UB  [SODFL1608X65N]
D4  PESD3V3S1UB  [SODFL1608X65N]
D5  PESD3V3S1UB  [SODFL1608X65N]
D6  PESD3V3S1UB  [SODFL1608X65N]
D7  PESD3V3S1UB  [SODFL1608X65N]
IC13  NC7SZ66P5X  [SOT65P210X110-5N]
J6  Milli-Grid™  [MOLEX_87832-1420]  (value not drawn)
R32  10k  [RESC1005X40N]
R33  10k  [RESC1005X40N]
R34  10k  [RESC1005X40N]
R35  0  [RESC1005X40N]
R36  0  [RESC1005X40N]
R37  0  [RESC1005X40N]
R38  0  [RESC1005X40N]
R40  0  [RESC1005X40N]
R41  0  [RESC1005X40N]
R42  0  [RESC1005X40N]
R43  0  [RESC1005X40N]
R44  0  [RESC1005X40N]
R45  0  [RESC1005X40N]
R46  0  [RESC1005X40N]
R115  10k  [RESC1005X40N]

### Ports
FMC1_JTAG (bidir, harness JTAG), FMC_JTAG_Override (bidir), FMC_PS# (in), FPGA_JTAG (bidir, harness FPGA_JTAG), USB_JTAG (out, harness USB_JTAG)

### Harnesses
JTAG: TCK, TDI, TDO, TMS, TRSTn
FPGA_JTAG: FPGA_TCK, FPGA_TDI, FPGA_TDO, FPGA_TMS

### Nets
GND: C95.1 D2.2(A) D3.2(A) D4.2(A) D5.2(A) D6.2(A) D7.2(A) IC13.3(GND) J6.3 J6.5 J6.7 J6.9 J6.11
P3V3: C95.2 IC13.5(VCC) J6.2 R32.2 R33.2 R34.2
FMC1_JTAG.TCK: R42.1 ; port FMC1_JTAG.TCK
FMC1_JTAG.TMS: R45.1 ; port FMC1_JTAG.TMS
FMC1_JTAG.TRSTn: R46.1 ; port FMC1_JTAG.TRSTn
FMC_PS#: R115.1 ; port FMC_PS#  [project net FMC1_MISC.FMC_PS#]
FMC_TDI: IC13.1(A) R43.1 ; port FMC1_JTAG.TDI  [project net FMC1_JTAG.TDI]
FMC_TDO: IC13.2(B) R44.1 ; port FMC1_JTAG.TDO  [project net FMC1_JTAG.TDO]
FPGA_TDI: D2.1(C) J6.10 R36.1 ; port FPGA_JTAG.FPGA_TDI  [also labelled PROG_TDI]  [project net FPGA_JTAG.FPGA_TDI]
FPGA_TDO: R41.1 R43.2 ; port FPGA_JTAG.FPGA_TDO  [project net FPGA_JTAG.FPGA_TDO]
PROG_TCK: D4.1(C) J6.6 R33.1 R35.1 R42.2 ; port FPGA_JTAG.FPGA_TCK  [project net FPGA_JTAG.FPGA_TCK]
PROG_TDO: D3.1(C) J6.8 R37.1 R41.2 R44.2
PROG_TMS: D5.1(C) J6.4 R34.1 R38.1 R45.2 ; port FPGA_JTAG.FPGA_TMS  [project net FPGA_JTAG.FPGA_TMS]
PROG_TRST: D7.1(C) R40.2 R46.2
USB_JTAG.EN_USB_JTAG: D6.1(C) J6.13 R32.1
USB_JTAG.USB_TCK: R35.2
USB_JTAG.USB_TDI: R36.2
USB_JTAG.USB_TDO: R37.2
USB_JTAG.USB_TMS: R38.2
NetIC13_4: IC13.4(OE) R115.2 ; port FMC_JTAG_Override
NetJ6_14: J6.14 R40.1

Not connected (* = marked no-connect by the designer): J6 1* 12*

### Buses and harness runs
harness FMC1_JTAG = port FMC1_JTAG
harness FPGA_JTAG = port FPGA_JTAG
harness USB_JTAG = port USB_JTAG

### Notes on the sheet
- FMC BYPASS OPTION
- Disable FMC by default
- Project/Equipment
- Document
- Designer
- Drawn by
- Check.by
- Copyright WUT ISE 2018.
  This documentation describes Open Hardware and is licensed under the CERN OHL v.1.1. You may redistribute and modify this documentation under the terms of the CERN OHL v.1.1. (http://ohwr.org/CERNOHL). This documentation is distributed WITHOUT ANY EXPRESS OR IMPLIED WARRANTY, INCLUDING OF MERCHANTABILITY, SATISFACTORY QUALITY AND FITNESS FOR A PARTICULAR PURPOSE. Please see the CERN OHL v.1.1 for applicable conditions.
- Contact
- File
- Last Mod.
- Print Date
- Sheet
- Size
- A3
- of
- Rev
- (in symbol R0402_10K_1%_0.0625W_100PPM) 1%

### Library data of the parts
C95 = CC0201_100NF_6.3V_10%_X5R: as C23 on sheet SDRAM_DDR3_4x16; Author: CERN DEM JLC; Case: 0201; Component Kind: Standard; Component Type: Standard; CreateDate: 03.12.2007; HelpURL: \\cern.ch\dfs\Applications\Altium\Datasheets\CC0201_X5R_AVX.pdf; LatestRevisionDate: 03.12.2007; Manufacturer Part Number: CC0201_100NF_6.3V_10%_X5R; Manufacturer1 ComponentHeight: 0.33mm; Manufacturer1 Example: AVX; Mounted: Yes; Part Number: CC0201_100NF_6.3V_10%_X5R; Pin Count: 2; SMD: Yes; Socket: No; Status: Not Recommended; Value: 100nF; Sense: No
D2-D7 = PESD3V3S1UB: ESD protection diode; Manufacturer: NXP SEMICONDUCTORS; Part Description: ESD protection diode (23kV); Voltage: 3V3; Power: 330W; PressFit: No; Bonding: No; Manufacturer Part Number: PESD3V3S1UB; PackageDescription: Ultra Small Outline Diode Flat Lead (SOD-523), Body; 1.2mm L X 0.8mm W X 0.65mm H, IPC Medium Density; Part Number: PESD3V3S1UB; Component Kind: Standard; Component Type: Standard; Device: PESD3V3S1UB; Pin Count: 2; Case: SOD523; Mounted: Yes; Socket: No; SMD: Yes; Sense: No; ComponentHeight: 0.65mm; HelpURL: \\cern.ch\dfs\Applications\Altium\Datasheets\PESD3V3S1UB.pdf; Author: CERN DEM JLC; CreateDate: 29.11.2012; LatestRevisionDate: 29.11.2012
IC13 = NC7SZ66P5X: TinyLogic® Low Voltage Single SPST Normally Open Bus Switch; Manufacturer: FAIRCHILD SEMICONDUCTOR; PressFit: No; Bonding: No; Part Number: NC7SZ66P5X; Component Kind: Standard; Component Type: Standard; Device: NC7SZ66P5X; PackageDescription: SOT353, SC70-5, SOT, 0.65mm Pitch, 5 pin, 1.25mm W X 2.00mm L X 1.10mm H, IPC Medium Density; Part Description: Low Voltage Single SPST Normally Open Bus Switch; Manufacturer Part Number: NC7SZ66P5X; Pin Count: 5; Case: SOT353; Mounted: Yes; Socket: No; SMD: Yes; Sense: No; ComponentHeight: 1.1mm; Author: CERN DEM JLC; HelpURL: \\cern.ch\dfs\Applications\Altium\Datasheets\NC7SZ66P5X.pdf; CreateDate: 07.07.2014; LatestRevisionDate: 07.07.2014
J6 = MOLEX_87832-1420: Connector 14 Male; Manufacturer: MOLEX; Part Description: 2.00mm (.079") Pitch Milli-Grid™ Header, Surface Mount, Vertical, Shrouded, 14 Circuits,with Locking Windows and Centre Polarization Slot, PCB Locator; PressFit: No; Manufacturer Part Number: 87832-1420; Part Number: MOLEX_87832-1420; Component Kind: Standard; Component Type: Standard; Pin Count: 14; Family: Milli-Grid™; Mounted: Yes; Socket: No; SMD: Yes; Sense: No; Status: None; ComponentHeight: 7.6mm; HelpURL: \\cern.ch\dfs\Applications\Altium\Datasheets\MOLEX_87832-1420.pdf; Author: CERN DEM JLC; CreateDate: 09.09.2008; LatestRevisionDate: 09.09.2008
R32-R34 R115 = R0402_10K_1%_0.0625W_100PPM: as R50 on sheet SDRAM_DDR3_4x16; Manufacturer Part Number: R0402_10K_1%_0.0625W_100PPM; Part Number: R0402_10K_1%_0.0625W_100PPM; Tolerance: ±1%; Value: 10k; Component Kind: Standard; Component Type: Standard; Pin Count: 2; Status: Not Recommended; Power: 0.0625W; Case: 0402; Mounted: Yes; Sense: No; Socket: No; SMD: Yes; Manufacturer1 Example: YAGEO PHYCOMP; Manufacturer1 ComponentHeight: 0.4mm; HelpURL: \\cern.ch\dfs\Applications\Altium\Datasheets\R0402_Phycomp_RC0402.pdf; Author: CERN DEM JLC; CreateDate: 03.12.2007; LatestRevisionDate: 17.10.2012
R35-R38 R40-R46 = R0402_0R_JUMPER: Resistor; Manufacturer: GENERIC; Part Description: 1A (0.05R Max DC Resistance) Zero Ohm Jumper; Manufacturer1 Part Number: 232270591001L; PressFit: No; Manufacturer Part Number: R0402_0R_JUMPER; Part Number: R0402_0R_JUMPER; Value: 0; Component Kind: Standard; Component Type: Standard; Pin Count: 2; Status: Not Recommended; Case: 0402; Mounted: Yes; Sense: No; Socket: No; SMD: Yes; Manufacturer1 Example: YAGEO PHYCOMP; Manufacturer1 ComponentHeight: 0.4mm; HelpURL: \\cern.ch\dfs\Applications\Altium\Datasheets\R0402_Phycomp_RC0402.pdf; Author: CERN DEM JLC; CreateDate: 03.12.2007; LatestRevisionDate: 17.10.2012